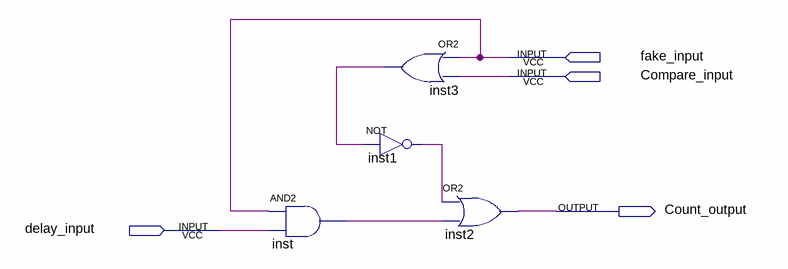
[diagram p0: schematic sheet]
// Quartus schematic fake_game.bdf as structural Verilog: 4 symbols, 4 pins
module fake_game (
  input  fake_input,
  input  Compare_input,
  input  delay_input,
  output Count_output
);

  wire inst1_out, inst3_out, inst_out;

  and inst (inst_out, fake_input, delay_input);
  or inst3 (inst3_out, fake_input, Compare_input);
  not inst1 (inst1_out, inst3_out);
  or inst2 (Count_output, inst1_out, inst_out);
endmodule
